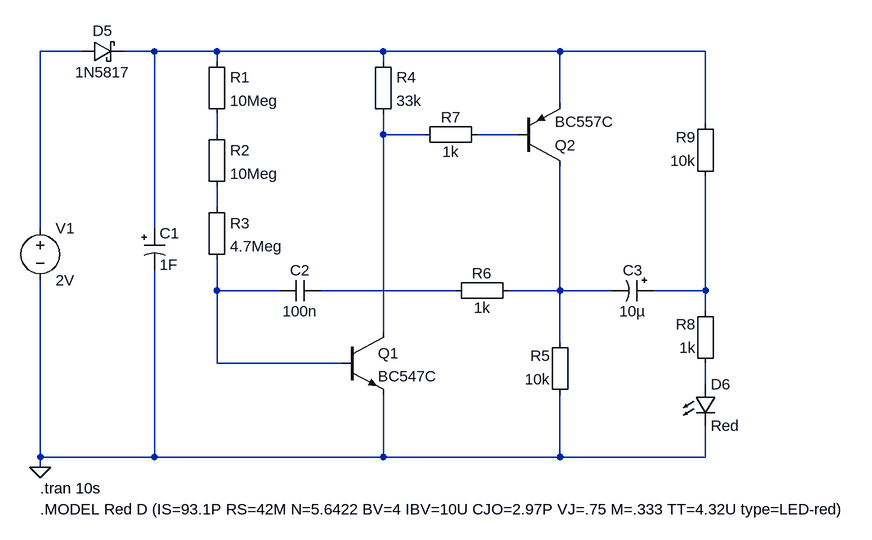
[diagram p0: schematic EBS.asc]
EBS.asc, the LTspice schematic file:
Version 4
SHEET 1 1168 680
WIRE -144 -208 -208 -208
WIRE -32 -208 -80 -208
WIRE 64 -208 -32 -208
WIRE 320 -208 64 -208
WIRE 592 -208 320 -208
WIRE 816 -208 592 -208
WIRE 64 -192 64 -208
WIRE 320 -192 320 -208
WIRE 592 -128 592 -208
WIRE 816 -96 816 -208
WIRE 64 -80 64 -112
WIRE 320 -80 320 -112
WIRE 384 -80 320 -80
WIRE 528 -80 464 -80
WIRE 64 32 64 0
WIRE -208 64 -208 -208
WIRE -32 64 -32 -208
WIRE 64 160 64 112
WIRE 160 160 64 160
WIRE 432 160 224 160
WIRE 592 160 592 -32
WIRE 592 160 512 160
WIRE 672 160 592 160
WIRE 816 160 816 -16
WIRE 816 160 736 160
WIRE 816 192 816 160
WIRE 320 224 320 -80
WIRE 592 240 592 160
WIRE 64 272 64 160
WIRE 256 272 64 272
WIRE 816 304 816 272
WIRE -208 416 -208 144
WIRE -32 416 -32 128
WIRE -32 416 -208 416
WIRE 320 416 320 320
WIRE 320 416 -32 416
WIRE 592 416 592 320
WIRE 592 416 320 416
WIRE 816 416 816 368
WIRE 816 416 592 416
WIRE -208 432 -208 416
FLAG -208 432 0
SYMBOL EuropeanPolcap -48 64 R0
SYMATTR InstName C1
SYMATTR Value 1F
SYMBOL cap 224 144 R90
WINDOW 0 0 32 VBottom 2
WINDOW 3 32 32 VTop 2
SYMATTR InstName C2
SYMATTR Value 100n
SYMBOL npn 256 224 R0
SYMATTR InstName Q1
SYMATTR Value BC547C
SYMBOL pnp 528 -32 M180
SYMATTR InstName Q2
SYMATTR Value BC557C
SYMBOL EuropeanPolcap 736 144 R90
WINDOW 0 0 32 VBottom 2
WINDOW 3 32 32 VTop 2
SYMATTR InstName C3
SYMATTR Value 10µ
SYMBOL LED 800 304 R0
SYMATTR InstName D6
SYMATTR Value Red
SYMBOL schottky -144 -192 R270
WINDOW 0 32 32 VTop 2
WINDOW 3 0 32 VBottom 2
SYMATTR InstName D5
SYMATTR Value 1N5817
SYMATTR Description Diode
SYMATTR Type diode
SYMBOL voltage -208 48 R0
WINDOW 123 0 0 Left 0
WINDOW 39 0 0 Left 0
SYMATTR InstName V1
SYMATTR Value 2V
SYMBOL Misc\\EuropeanResistor 48 -208 R0
SYMATTR InstName R1
SYMATTR Value 10Meg
SYMBOL Misc\\EuropeanResistor 48 -96 R0
SYMATTR InstName R2
SYMATTR Value 10Meg
SYMBOL Misc\\EuropeanResistor 48 16 R0
SYMATTR InstName R3
SYMATTR Value 4.7Meg
SYMBOL Misc\\EuropeanResistor 304 -208 R0
SYMATTR InstName R4
SYMATTR Value 33k
SYMBOL Misc\\EuropeanResistor 528 144 R90
WINDOW 0 5 56 VBottom 2
WINDOW 3 27 56 VTop 2
SYMATTR InstName R6
SYMATTR Value 1k
SYMBOL Misc\\EuropeanResistor 480 -96 R90
WINDOW 0 5 56 VBottom 2
WINDOW 3 27 56 VTop 2
SYMATTR InstName R7
SYMATTR Value 1k
SYMBOL Misc\\EuropeanResistor 608 336 R180
WINDOW 0 31 76 Left 2
WINDOW 3 31 40 Left 2
SYMATTR InstName R5
SYMATTR Value 10k
SYMBOL Misc\\EuropeanResistor 832 288 R180
WINDOW 0 31 76 Left 2
WINDOW 3 31 40 Left 2
SYMATTR InstName R8
SYMATTR Value 1k
SYMBOL Misc\\EuropeanResistor 832 0 R180
WINDOW 0 31 76 Left 2
WINDOW 3 31 40 Left 2
SYMATTR InstName R9
SYMATTR Value 10k
TEXT -208 464 Left 2 !.tran 10s
TEXT -208 496 Left 2 !.MODEL Red D (IS=93.1P RS=42M N=5.6422 BV=4 IBV=10U CJO=2.97P VJ=.75 M=.333 TT=4.32U type=LED-red)

The netlist it stands for:
* EBS.asc
C1 N002 0 1F
C2 N008 N007 100n
Q1 N004 N007 0 0 BC547C
Q2 N009 N005 N002 0 BC557C
C3 N010 N009 10µ
D6 N011 0 Red
D5 N001 N002 1N5817
V1 N001 0 2V
R1 N002 N003 10Meg
R2 N003 N006 10Meg
R3 N006 N007 4.7Meg
R4 N002 N004 33k
R6 N009 N008 1k
R7 N005 N004 1k
R5 0 N009 10k
R8 N011 N010 1k
R9 N010 N002 10k
.model D D
.lib standard.dio
.model NPN NPN
.model PNP PNP
.lib standard.bjt
.tran 10s
.MODEL Red D (IS=93.1P RS=42M N=5.6422 BV=4 IBV=10U CJO=2.97P VJ=.75 M=.333 TT=4.32U type=LED-red)
.backanno
.end